# EAGLE design 7segement4digits1badidea-max7219-smd-mk-5.0 (EAGLE 6.5.0)
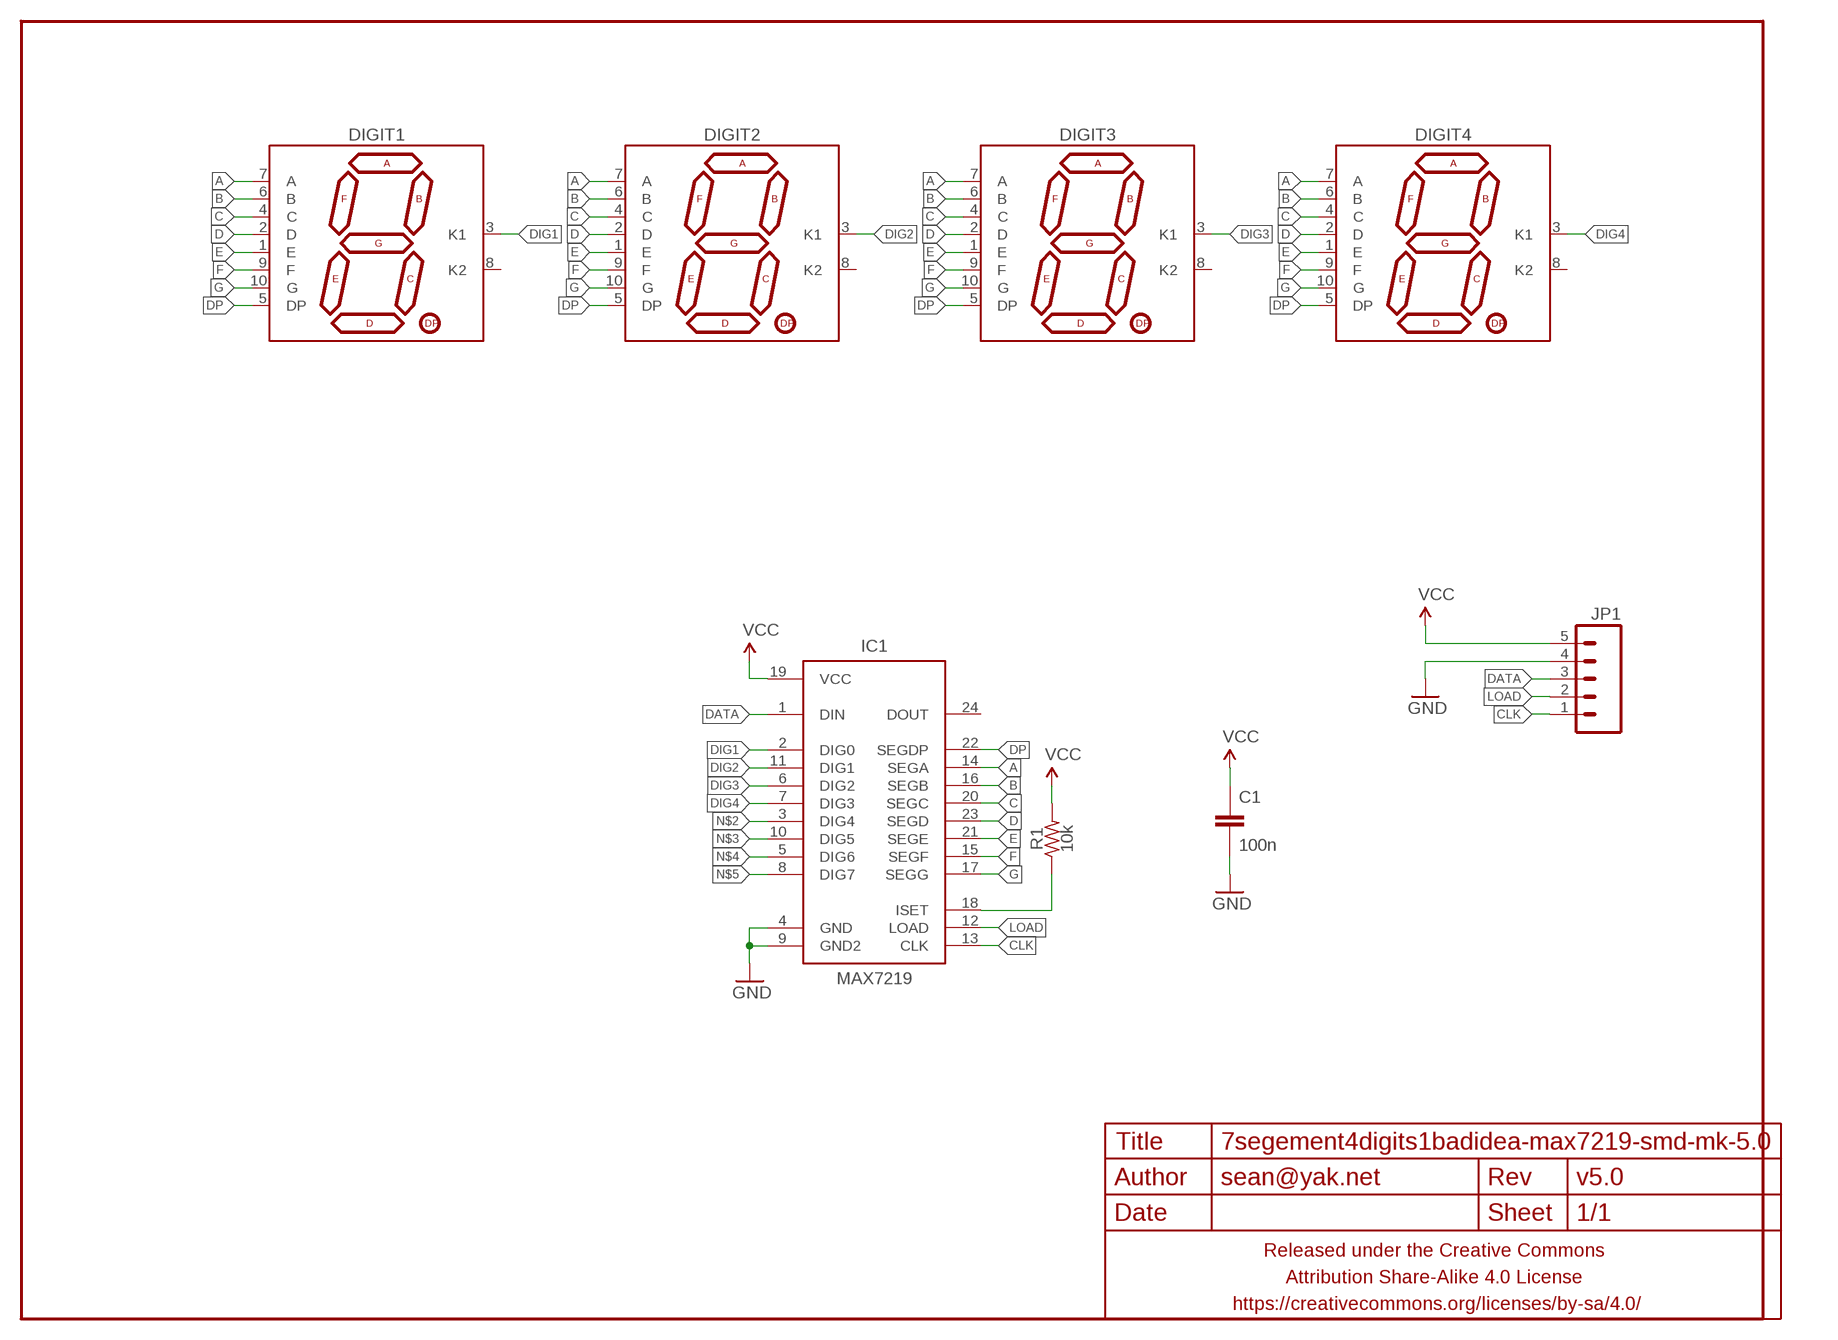
[diagram p0: schematic, sheet 1]

## Parts
C1  100n  CAPACITOR-CERAMICC0805  [C0805]
DIGIT1  7SEG_1DIGPTH-25.4MM  [7SEG_1DIG_25.4MM]
DIGIT2  7SEG_1DIGPTH-25.4MM  [7SEG_1DIG_25.4MM]
DIGIT3  7SEG_1DIGPTH-25.4MM  [7SEG_1DIG_25.4MM]
DIGIT4  7SEG_1DIGPTH-25.4MM  [7SEG_1DIG_25.4MM]
FRAME1  FRAME-LETTERNO_PACKAGE  [DUMMY]
IC1  MAX7219  MAX7219SOIC-W  [SO24W]
JP1  M05PTH-CENTERED  [1X05_PTH_CENTERED]
R1  10k  RESISTORR0805  [R0805]

## Nets
A: DIGIT1.7(A) DIGIT2.7(A) DIGIT3.7(A) DIGIT4.7(A) IC1.14(SEGA)
B: DIGIT1.6(B) DIGIT2.6(B) DIGIT3.6(B) DIGIT4.6(B) IC1.16(SEGB)
C: DIGIT1.4(C) DIGIT2.4(C) DIGIT3.4(C) DIGIT4.4(C) IC1.20(SEGC)
CLK: IC1.13(CLK) JP1.1
D: DIGIT1.2(D) DIGIT2.2(D) DIGIT3.2(D) DIGIT4.2(D) IC1.23(SEGD)
DATA: IC1.1(DIN) JP1.3
DIG1: DIGIT1.3(K1) IC1.2(DIG0)
DIG2: DIGIT2.3(K1) IC1.11(DIG1)
DIG3: DIGIT3.3(K1) IC1.6(DIG2)
DIG4: DIGIT4.3(K1) IC1.7(DIG3)
DP: DIGIT1.5(DP) DIGIT2.5(DP) DIGIT3.5(DP) DIGIT4.5(DP) IC1.22(SEGDP)
E: DIGIT1.1(E) DIGIT2.1(E) DIGIT3.1(E) DIGIT4.1(E) IC1.21(SEGE)
F: DIGIT1.9(F) DIGIT2.9(F) DIGIT3.9(F) DIGIT4.9(F) IC1.15(SEGF)
G: DIGIT1.10(G) DIGIT2.10(G) DIGIT3.10(G) DIGIT4.10(G) IC1.17(SEGG)
GND: C1.2 IC1.4(GND) IC1.9(GND2) JP1.4
LOAD: IC1.12(LOAD) JP1.2
N$1: IC1.18(ISET) R1.1
N$2: IC1.3(DIG4)
N$3: IC1.10(DIG5)
N$4: IC1.5(DIG6)
N$5: IC1.8(DIG7)
VCC: C1.1 IC1.19(VCC) JP1.5 R1.2
Unconnected: DIGIT1.8(K2) DIGIT2.8(K2) DIGIT3.8(K2) DIGIT4.8(K2) IC1.24(DOUT)

## Library data of the parts
C1 = A_butts:CAPACITOR-CERAMIC: CAPACITOR, European symbol
DIGIT1-DIGIT4 = A_butts:7SEG_1DIG
FRAME1 = A_butts:FRAME-LETTER: Schematic Frame Standard 8.5x11 US Letter frame; DESIGNER: sean@yak.net; VERSION: v5.0
IC1 = A_butts:MAX7219: 8-digit, 8-segment LED display driver, serial input
JP1 = A_butts:M05: Header 5 Standard 5-pin 0.1" header. Use with straight break away headers (SKU : PRT-00116), right angle break away headers (PRT-00553), swiss pins (PRT-00743), machine pins (PRT-00117), and female headers (PRT-00115). Molex polarized connector foot print use with SKU : PRT-08230 with associated crimp pins and housings.
R1 = A_butts:RESISTOR: RESISTOR, American symbol

## Board
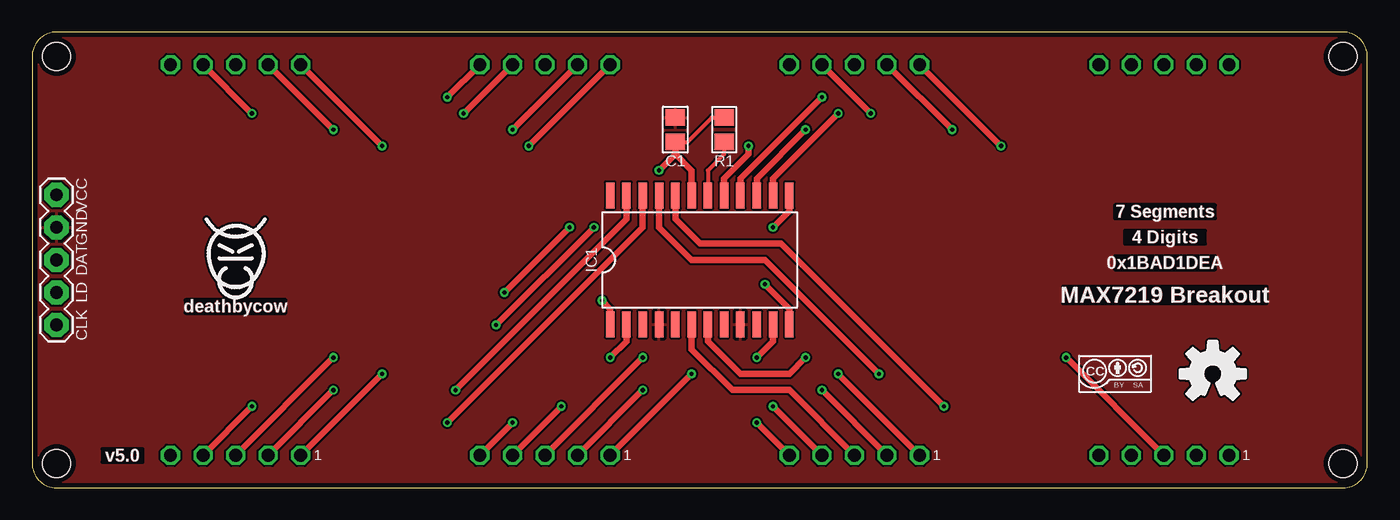
[diagram p1: board, top side]
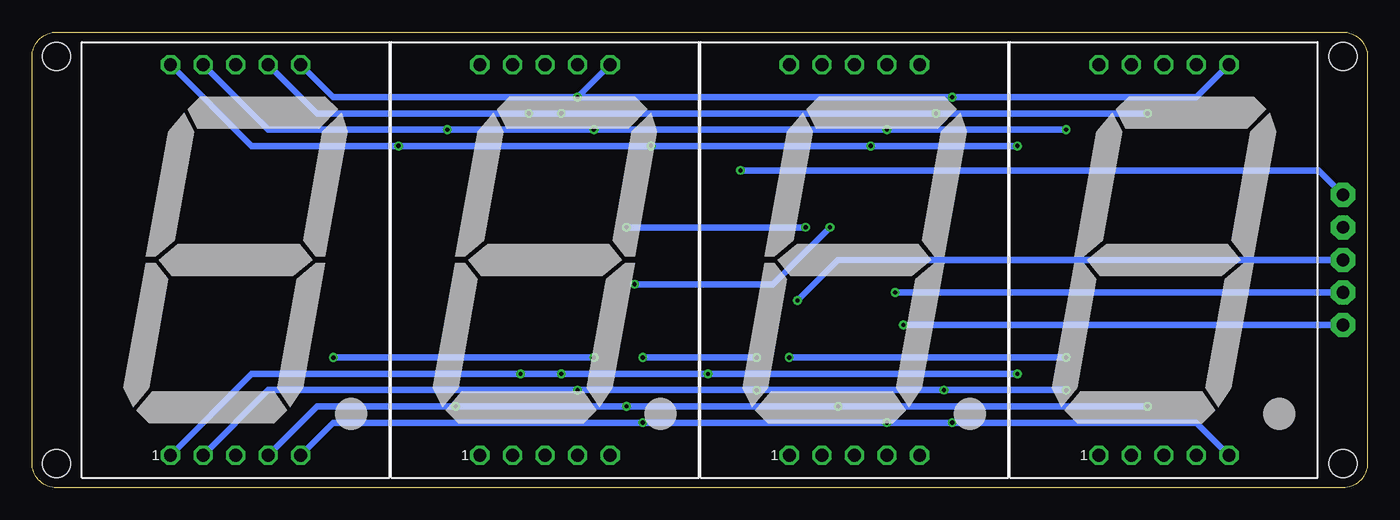
[diagram p2: board, bottom side, seen from below]

Size 104.14 x 35.56 mm. Coordinates in mm from the lower left corner, seen from the top.
Outline: 1.91,0 102.23,0 arc90 104.14,1.91 104.14,33.66 arc90 102.23,35.56 1.91,35.56 arc90 0,33.66 0,1.91 arc90 1.91,0
Copper layers (1*16): Top 0.0356mm / dielectric 1.5011mm / Bottom 0.0356mm
Design rules "LaenPCBOrder2": minimum track width 6mil, minimum drill 13mil, track to track 6mil, track to pad 6mil, pad to pad 6mil, via to via 6mil, smd to smd 6mil, copper to edge 15mil, drill to drill 6mil, minimum pad ring 7mil, minimum via ring 7mil, stop-mask expansion 3mil, vias tented up to drill 20mil, thermal gap 10mil
Holes 2.2 mm at 1.91,33.66 1.91,1.91 102.23,1.91 102.23,33.66

### Footprints (pad centres in the part's own frame; a part is rotated, then mirrored left to right if it is on the bottom)
C0805 = smd 1.3 x 1.5: 1 -0.95,0; 2 0.95,0
7SEG_1DIG_25.4MM = drill 1 pad 1.5 octagon: 1 -5.08,-15.24; 2 -2.54,-15.24; 3 0,-15.24; 4 2.54,-15.24; 5 5.08,-15.24; 6 5.08,15.24; 7 2.54,15.24; 8 0,15.24; 9 -2.54,15.24; 10 -5.08,15.24
SO24W = smd 0.66 x 2.032: 1 -6.985,-5.029; 2 -5.715,-5.029; 3 -4.445,-5.029; 4 -3.175,-5.029; 5 -1.905,-5.029; 6 -0.635,-5.029; 7 0.635,-5.029; 8 1.905,-5.029; 9 3.175,-5.029; 10 4.445,-5.029; 11 5.715,-5.029; 12 6.985,-5.029; 13 6.985,5.029; 14 5.715,5.029; 15 4.445,5.029; 16 3.175,5.029; 17 1.905,5.029; 18 0.635,5.029; 19 -0.635,5.029; 20 -1.905,5.029; 21 -3.175,5.029; 22 -4.445,5.029; 23 -5.715,5.029; 24 -6.985,5.029
1X05_PTH_CENTERED = drill 1 pad 1.88 octagon: 1 -5.08,0; 2 -2.54,0; 3 0,0; 4 2.54,0; 5 5.08,0
R0805 = smd 1.3 x 1.5: 1 -0.95,0; 2 0.95,0

### Placement (x,y rotation side)
C1  50.16,27.94 90 top
DIGIT1  15.88,17.78 0 bottom
DIGIT2  40.01,17.78 0 bottom
DIGIT3  64.14,17.78 0 bottom
DIGIT4  88.27,17.78 0 bottom
FRAME1  0,0 0 top
IC1  52.07,17.78 0 top
JP1  1.91,17.78 90 top
R1  53.98,27.94 90 top
U$1  [CC-BY-SA-4.0-NO-URL]  84.45,8.89 0 top
U$2  [COW_SMALL_METAL]  15.88,18.41 0 top
U$3  [OSHWLOGO_TOP_0.2_A]  92.08,8.89 0 top

### Tracks (layer width: path | path; a pad name or v marks a point on that pad's centre or on a via)
A  (via drill 0.33)
  Top 0.508: v17.14,29.21 DIGIT1.7 | v33.66,29.21 DIGIT2.7 | IC1.14 57.78,24.13 v62.87,29.21 | DIGIT3.7 v65.41,29.21
  Bottom 0.508: v17.14,29.21 v33.66,29.21 v62.87,29.21 v65.41,29.21 81.92,29.21 DIGIT4.7
B  (via drill 0.33)
  Top 0.508: v32.38,30.48 DIGIT2.6 | IC1.16 55.24,24.13 v61.59,30.48
  Bottom 0.508: v61.59,30.48 v32.38,30.48 13.34,30.48 DIGIT1.6 | v61.59,30.48 80.64,30.48 DIGIT4.6 | v61.59,30.48 DIGIT3.6
C  (via drill 0.33)
  Top 0.508: v17.14,6.35 DIGIT1.4 | DIGIT2.4 v41.27,6.35 | DIGIT3.4 v57.78,6.35 | IC1.20 50.16,20.95 52.07,19.05 58.42,19.05 v71.12,6.35
  Bottom 0.508: v17.14,6.35 v41.27,6.35 v57.78,6.35 v71.12,6.35 81.92,6.35 DIGIT4.4
CLK  (via drill 0.33)
  Top 0.508: IC1.13 59.05,21.59 v57.78,20.32 | v36.2,12.7 v43.81,20.32
  Bottom 0.508: JP1.1 v36.2,12.7 | v43.81,20.32 v57.78,20.32
D  (via drill 0.33)
  Top 0.508: v23.5,7.62 DIGIT1.2 | DIGIT2.2 v47.62,7.62 | DIGIT3.2 v61.59,7.62 | IC1.23 46.35,20.95 v33.02,7.62
  Bottom 0.508: v23.5,7.62 v33.02,7.62 v47.62,7.62 v61.59,7.62 85.72,7.62 DIGIT4.2
DATA  (via drill 0.33)
  Top 0.508: IC1.1 45.09,13.97 v44.45,14.61
  Bottom 0.508: JP1.3 41.27,17.78 v44.45,14.61
DIG1  (via drill 0.33)
  Top 0.508: IC1.2 46.35,11.43 v45.09,10.16 | v23.5,10.16 DIGIT1.3
  Bottom 0.508: v45.09,10.16 v23.5,10.16
DIG2  (via drill 0.33)
  Top 0.508: IC1.11 57.78,11.43 v56.52,10.16 | v47.62,10.16 DIGIT2.3
  Bottom 0.508: v56.52,10.16 v47.62,10.16
DIG3
  Top 0.508: IC1.6 51.44,10.79 54.61,7.62 59.05,7.62 DIGIT3.3
DIG4  (via drill 0.33)
  Top 0.508: IC1.7 52.7,11.43 55.24,8.89 59.05,8.89 v60.33,10.16 | v80.64,10.16 DIGIT4.3
  Bottom 0.508: v60.33,10.16 v80.64,10.16
DP  (via drill 0.33)
  Top 0.508: DIGIT2.5 v37.47,5.08 | DIGIT3.5 v56.52,5.08 | IC1.22 47.62,20.32 v32.38,5.08
  Bottom 0.508: DIGIT1.5 13.34,5.08 v32.38,5.08 v37.47,5.08 v56.52,5.08 80.64,5.08 DIGIT4.5
E  (via drill 0.33)
  Top 0.508: v27.3,8.89 DIGIT1.1 | DIGIT2.1 v51.44,8.89 | DIGIT3.1 v62.87,8.89 | IC1.21 48.9,20.32 51.44,17.78 57.15,17.78 v66.04,8.89
  Bottom 0.508: v27.3,8.89 v51.44,8.89 v62.87,8.89 v66.04,8.89 87,8.89 DIGIT4.1
F  (via drill 0.33)
  Top 0.508: v23.5,27.94 DIGIT1.9 | v37.47,27.94 DIGIT2.9 | IC1.15 56.52,24.13 v60.33,27.94 | DIGIT3.9 v71.75,27.94
  Bottom 0.508: v23.5,27.94 v37.47,27.94 v60.33,27.94 v71.75,27.94 85.72,27.94 DIGIT4.9
G  (via drill 0.33)
  Top 0.508: v27.3,26.67 DIGIT1.10 | IC1.17 53.98,24.13 55.88,26.04 v55.88,26.67 | v38.73,26.67 DIGIT2.10 | DIGIT3.10 v75.56,26.67
  Bottom 0.508: v27.3,26.67 v38.73,26.67 v55.88,26.67 v75.56,26.67 87,26.67 DIGIT4.10
GND
  pour Top: 1.91,35.56 102.23,35.56 arc-90 104.14,33.66 104.14,1.91 arc-90 102.23,0 1.91,0 arc-90 0,1.91 0,33.66 arc-90
LOAD  (via drill 0.33)
  Top 0.508: v36.83,15.24 v41.91,20.32 | v57.15,15.88 59.05,13.97 IC1.12
  Bottom 0.508: JP1.2 v36.83,15.24 | v41.91,20.32 46.35,15.88 v57.15,15.88
N$1
  Top 0.305: R1.1 53.98,26.04 52.7,24.77 IC1.18
VCC  (via drill 0.33)
  Top 0.305: C1.1 51.12,26.99 53.02,28.89 R1.2
  Top 0.508: C1.1 50.16,26.04 | 50.16,26.04 51.44,24.77 IC1.19 | v48.9,24.77 50.16,26.04
  Bottom 0.508: JP1.5 3.81,24.77 v48.9,24.77

### Text on the board
Top: 7 Segments | 4 Digits | 0x1BAD1DEA | MAX7219 Breakout
tPlace: VCC | 7 Segments | GND | 4 Digits | DAT | 0x1BAD1DEA | LD | MAX7219 Breakout | CLK